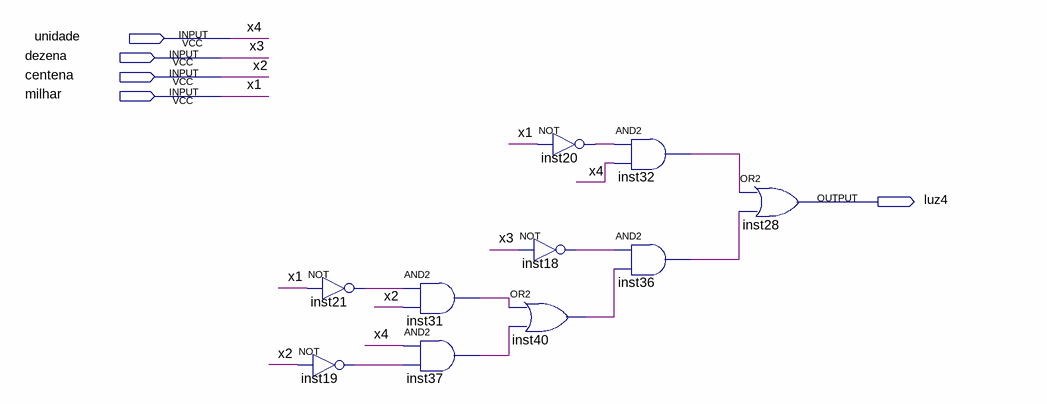
[diagram p0: schematic sheet]
// Quartus schematic luz4.bdf as structural Verilog: 10 symbols, 5 pins
module luz4 (
  input  unidade,
  input  dezena,
  input  centena,
  input  milhar,
  output luz4
);

  wire inst18_out, inst19_out, inst20_out, inst21_out, inst31_out, inst32_out, inst36_out, inst37_out,
       inst40_out;

  not inst21 (inst21_out, milhar);
  not inst19 (inst19_out, centena);
  and inst31 (inst31_out, inst21_out, centena);
  and inst37 (inst37_out, unidade, inst19_out);
  not inst20 (inst20_out, milhar);
  not inst18 (inst18_out, dezena);
  or inst40 (inst40_out, inst31_out, inst37_out);
  and inst32 (inst32_out, inst20_out, unidade);
  and inst36 (inst36_out, inst18_out, inst40_out);
  or inst28 (luz4, inst32_out, inst36_out);

  // Other names for the same wires on the sheet: x1 = milhar; x2 = centena; x3 = dezena; x4 = unidade
endmodule
